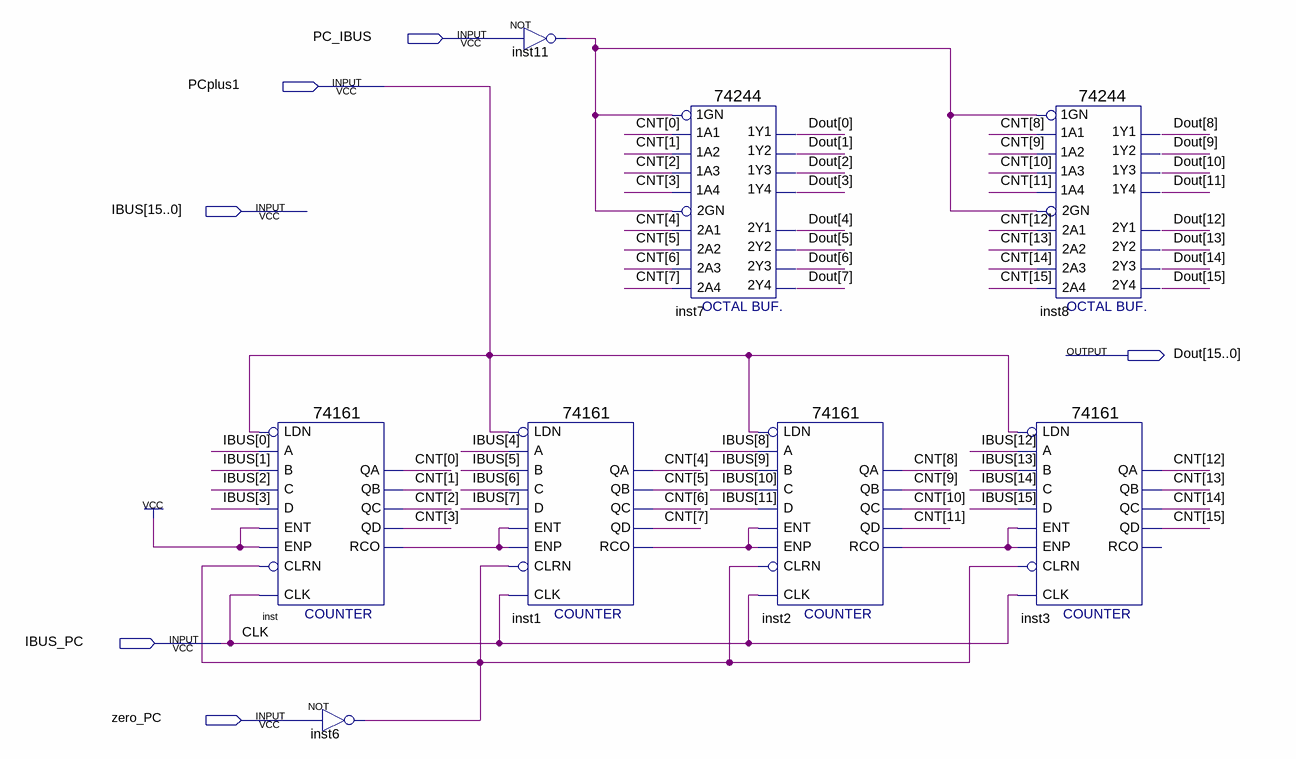
[diagram p0: schematic sheet]
// Quartus schematic PC.bdf as structural Verilog: 8 symbols, 6 pins
module PC (
  input  PC_IBUS,
  input  PCplus1,
  input  [15:0] IBUS,
  input  IBUS_PC,
  input  zero_PC,
  output [15:0] Dout
);

  wire inst1_rco, inst2_rco, inst6_out, inst11_out, inst_rco;
  wire [15:0] CNT;

  \74161  inst (
    .CLRN(inst6_out), .CLK(IBUS_PC), .ENP(1'b1), .LDN(PCplus1), .A(IBUS[0]), .D(IBUS[3]), .ENT(1'b1),
    .B(IBUS[1]), .C(IBUS[2]), .QD(CNT[3]), .QC(CNT[2]), .QB(CNT[1]), .QA(CNT[0]), .RCO(inst_rco));
  not inst6 (inst6_out, zero_PC);
  not inst11 (inst11_out, PC_IBUS);
  \74161  inst1 (
    .CLRN(inst6_out), .CLK(IBUS_PC), .ENP(inst_rco), .LDN(PCplus1), .A(IBUS[4]), .D(IBUS[7]), .ENT(inst_rco),
    .B(IBUS[5]), .C(IBUS[6]), .QD(CNT[7]), .QC(CNT[6]), .QB(CNT[5]), .QA(CNT[4]), .RCO(inst1_rco));
  \74244  inst7 (
    .\1A2 (CNT[1]), .\1A4 (CNT[3]), .\1A1 (CNT[0]), .\1A3 (CNT[2]), .\1GN (inst11_out), .\2A3 (CNT[6]),
    .\2GN (inst11_out), .\2A1 (CNT[4]), .\2A4 (CNT[7]), .\2A2 (CNT[5]), .\1Y2 (Dout[1]), .\1Y4 (Dout[3]),
    .\2Y1 (Dout[4]), .\1Y1 (Dout[0]), .\2Y3 (Dout[6]), .\2Y4 (Dout[7]), .\1Y3 (Dout[2]), .\2Y2 (Dout[5]));
  \74161  inst2 (
    .CLRN(inst6_out), .CLK(IBUS_PC), .ENP(inst1_rco), .LDN(PCplus1), .A(IBUS[8]), .D(IBUS[11]),
    .ENT(inst1_rco), .B(IBUS[9]), .C(IBUS[10]), .QD(CNT[11]), .QC(CNT[10]), .QB(CNT[9]), .QA(CNT[8]),
    .RCO(inst2_rco));
  \74244  inst8 (
    .\1A2 (CNT[9]), .\1A4 (CNT[11]), .\1A1 (CNT[8]), .\1A3 (CNT[10]), .\1GN (inst11_out), .\2A3 (CNT[14]),
    .\2GN (inst11_out), .\2A1 (CNT[12]), .\2A4 (CNT[15]), .\2A2 (CNT[13]), .\1Y2 (Dout[9]), .\1Y4 (Dout[11]),
    .\2Y1 (Dout[12]), .\1Y1 (Dout[8]), .\2Y3 (Dout[14]), .\2Y4 (Dout[15]), .\1Y3 (Dout[10]), .\2Y2 (Dout[13]));
  \74161  inst3 (
    .CLRN(inst6_out), .CLK(IBUS_PC), .ENP(inst2_rco), .LDN(PCplus1), .A(IBUS[12]), .D(IBUS[15]),
    .ENT(inst2_rco), .B(IBUS[13]), .C(IBUS[14]), .QD(CNT[15]), .QC(CNT[14]), .QB(CNT[13]), .QA(CNT[12]));  // open: RCO

  // Other names for the same wires on the sheet: CLK = IBUS_PC
endmodule
